# Altium schematic sheet H桥.SchDoc
size A4
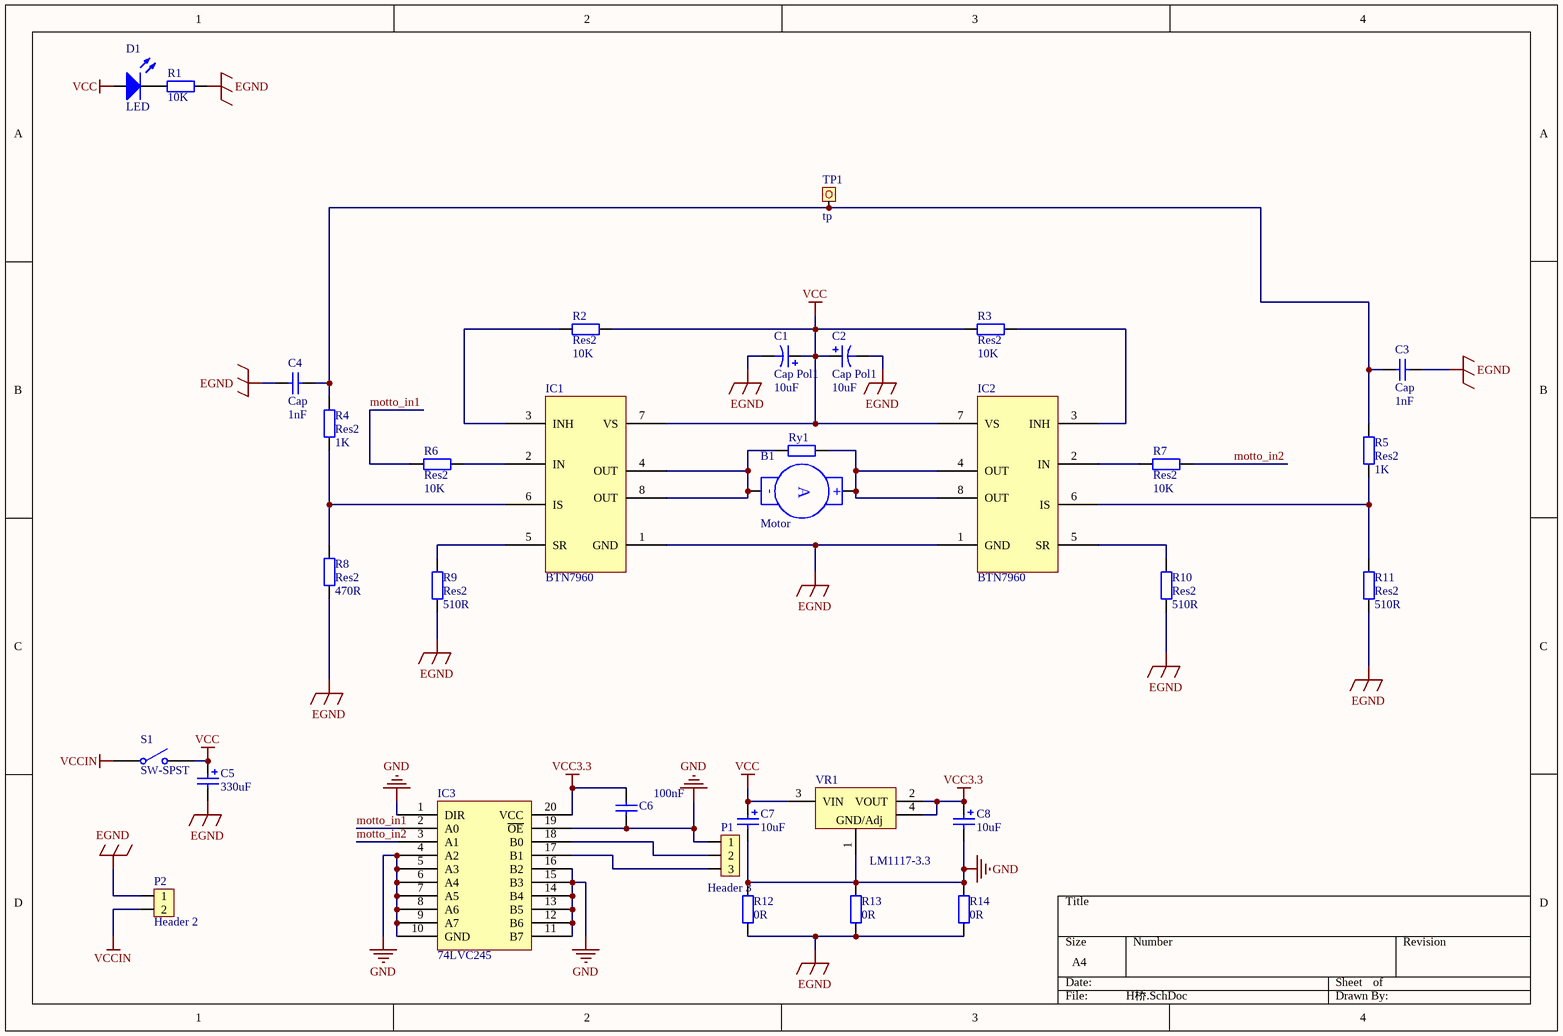
[diagram p0: H桥.SchDoc]

## Parts
B1  Motor  [KF301-2P]
C1  Cap Pol1  value 10uF  [1206(2)]
C2  Cap Pol1  value 10uF  [1206(2)]
C3  Cap  value 1nF  [1206(2)]
C4  Cap  value 1nF  [1206(2)]
C5  330uF  [Inductor/8mm]
C6  100nF  [1206(2)]
C7  10uF  [1206(2)]
C8  10uF  [1206(2)]
D1  LED  [1206(2)]
IC1  BTN7960  [PG-TO263-7-1]
IC2  BTN7960  [PG-TO263-7-1]
IC3  74LVC245  [TSSOP20 74lvc245]
P1  Header 3  [XH2.54_3P]
P2  Header 2  [KF301-2P]
R1  10K  [1206(2)]
R2  Res2  value 10K  [1206(2)]
R3  Res2  value 10K  [1206(2)]
R4  Res2  value 1K  [1206(2)]
R5  Res2  value 1K  [1206(2)]
R6  Res2  value 10K  [1206(2)]
R7  Res2  value 10K  [1206(2)]
R8  Res2  value 470R  [1206(2)]
R9  Res2  value 510R  [1206(2)]
R10  Res2  value 510R  [1206(2)]
R11  Res2  value 510R  [1206(2)]
R12  0R  [1206(2)]
R13  0R  [1206(2)]
R14  0R  [1206(2)]
Ry1  (no value)  [1206(2)]
S1  SW-SPST  [switch-black]
TP1  tp  [TP1]
VR1  LM1117-3.3  [SOT-223]

## Nets
EGND: C1.2 C2.2 C3.1 C4.1 C5.2 IC1.1(GND) IC2.1(GND) P2.1 R1.1 R8.1 R9.1 R10.1 R11.1 R12.1 R13.1 R14.1
GND: C6.1 C7.2 C8.2 IC3.1(DIR) IC3.4(A2) IC3.5(A3) IC3.6(A4) IC3.7(A5) IC3.8(A6) IC3.9(A7) IC3.10(GND) IC3.11(B7) IC3.12(B6) IC3.13(B5) IC3.14(B4) IC3.15(B3) IC3.16(B2) IC3.19(~{OE}) P1.1 R12.2 R13.2 R14.2 VR1.1(GND/Adj)
VCC: C1.1 C2.1 C5.1 C7.1 D1.1 IC1.7(VS) IC2.7(VS) R2.2 R3.1 S1.2(NO) VR1.3(VIN)
VCC3.3: C6.2 C8.1 IC3.20(VCC) VR1.2(VOUT) VR1.4(VOUT)
VCCIN: P2.2 S1.1(COMMON)
motto_in1: IC3.2(A0) R6.1
motto_in2: IC3.3(A1) R7.2
NetB1_1: B1.1(+) IC2.4(OUT) IC2.8(OUT) Ry1.2
NetB1_2: B1.2(-) IC1.4(OUT) IC1.8(OUT) Ry1.1
NetC3_2: C3.2 C4.2 R4.2 R5.2 TP1.1
NetD1_2: D1.2 R1.2
NetIC1_2: IC1.2(IN) R6.2
NetIC1_3: IC1.3(INH) R2.1
NetIC1_5: IC1.5(SR) R9.2
NetIC1_6: IC1.6(IS) R4.1 R8.2
NetIC2_2: IC2.2(IN) R7.1
NetIC2_3: IC2.3(INH) R3.2
NetIC2_5: IC2.5(SR) R10.2
NetIC2_6: IC2.6(IS) R5.1 R11.2
NetIC3_17: IC3.17(B1) P1.3
NetIC3_18: IC3.18(B0) P1.2

## Notes on the sheet
- (in symbol Motor Servo) A

## Library data of the parts
B1 = Motor Servo: Servo Motor
C1 C2 C5 C7 C8 = Cap Pol1: Polarized Capacitor (Radial)
  C1 C2: Published: 8-Jun-2000; LatestRevisionDate: 17-Jul-2002; LatestRevisionNote: Re-released for DXP Platform.; PackageReference: RB7.6-15; Publisher: Altium Limited; PackageDescription: Polarized Capacitor (Radial); 2 Leads
C3 C4 C6 = Cap: Capacitor
  C3 C4: Published: 8-Jun-2000; LatestRevisionDate: 17-Jul-2002; LatestRevisionNote: Re-released for DXP Platform.; PackageReference: RAD-0.3; Publisher: Altium Limited; PackageDescription: Radial Cap, Thru-Hole; 2 Leads; 0.3 in Pin Spacing
D1 = LED: Typical INFRARED GaAs LED
P1 = Header 3: Header, 3-Pin
P2 = Header 2: Header, 2-Pin
R1 R12-R14 Ry1 = Res: Resistor
R2-R11 = Res2: Resistor; Published: 8-Jun-2000; LatestRevisionDate: 17-Jul-2002; LatestRevisionNote: Re-released for DXP Platform.; PackageReference: AXIAL-0.4; Publisher: Altium Limited; PackageDescription: Axial Device, Thru-Hole; 2 Leads; 0.4 in Pin Spacing
S1 = SW-SPST: Single-Pole, Single-Throw Switch; Published: 24-Mar-1999; LatestRevisionDate: 17-Jul-2002; LatestRevisionNote: Re-released for DXP Platform.; PackageReference: SPST-2; Publisher: Altium Limited; PackageDescription: Switch; 2 Leads
VR1 = Volt_Reg_1117: Voltage Regulator